# EAGLE design large_led_ring (EAGLE 9.4.2)
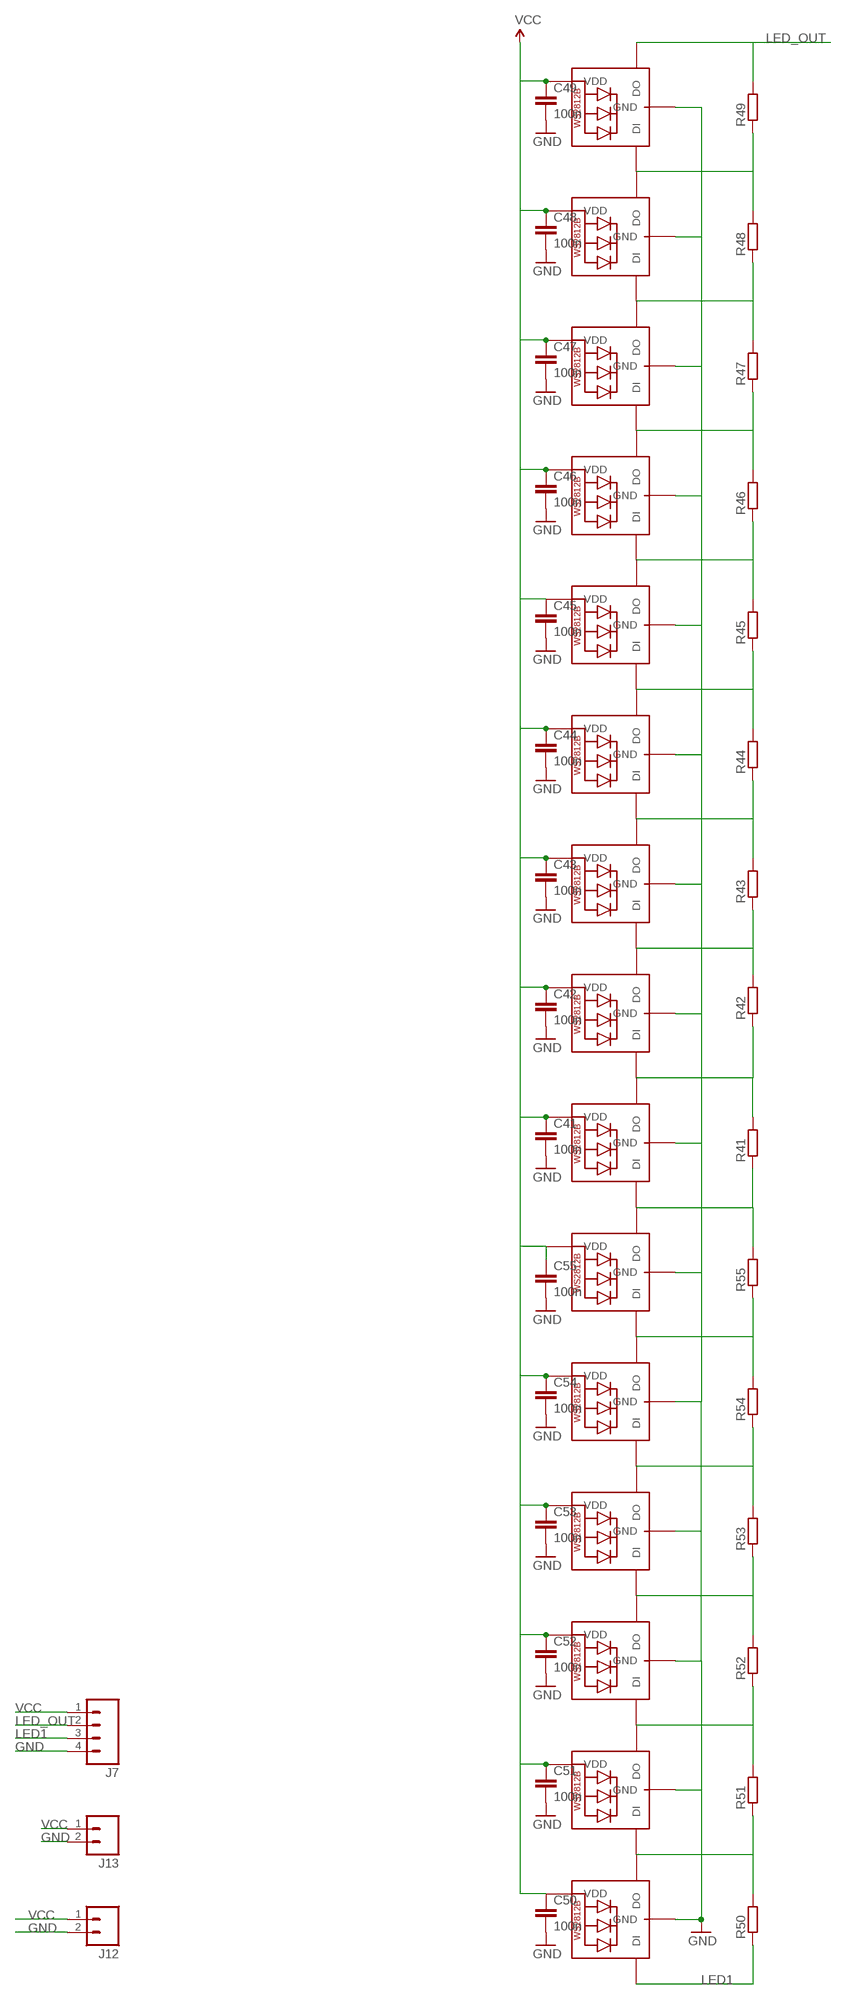
[diagram p0: schematic, sheet 1]

## Parts
C41  100n  CAP0603-CAP  [0603-CAP]
C42  100n  CAP0603-CAP  [0603-CAP]
C43  100n  CAP0603-CAP  [0603-CAP]
C44  100n  CAP0603-CAP  [0603-CAP]
C45  100n  CAP0603-CAP  [0603-CAP]
C46  100n  CAP0603-CAP  [0603-CAP]
C47  100n  CAP0603-CAP  [0603-CAP]
C48  100n  CAP0603-CAP  [0603-CAP]
C49  100n  CAP0603-CAP  [0603-CAP]
C50  100n  CAP0603-CAP  [0603-CAP]
C51  100n  CAP0603-CAP  [0603-CAP]
C52  100n  CAP0603-CAP  [0603-CAP]
C53  100n  CAP0603-CAP  [0603-CAP]
C54  100n  CAP0603-CAP  [0603-CAP]
C55  100n  CAP0603-CAP  [0603-CAP]
J7  M04NO_SILK_ALL_ROUND  [1X04_NO_SILK_ALL_ROUND]
J12  M021X02_NO_SILK  [1X02_NO_SILK]
J13  M021X02_NO_SILK  [1X02_NO_SILK]
LED31  WS2812B3535  [LED3535]
LED32  WS2812B3535  [LED3535]
LED33  WS2812B3535  [LED3535]
LED34  WS2812B3535  [LED3535]
LED35  WS2812B3535  [LED3535]
LED36  WS2812B3535  [LED3535]
LED37  WS2812B3535  [LED3535]
LED38  WS2812B3535  [LED3535]
LED39  WS2812B3535  [LED3535]
LED40  WS2812B3535  [LED3535]
LED41  WS2812B3535  [LED3535]
LED42  WS2812B3535  [LED3535]
LED43  WS2812B3535  [LED3535]
LED44  WS2812B3535  [LED3535]
LED45  WS2812B3535  [LED3535]
R41  R-EU_R0603  [R0603]
R42  R-EU_R0603  [R0603]
R43  R-EU_R0603  [R0603]
R44  R-EU_R0603  [R0603]
R45  R-EU_R0603  [R0603]
R46  R-EU_R0603  [R0603]
R47  R-EU_R0603  [R0603]
R48  R-EU_R0603  [R0603]
R49  R-EU_R0603  [R0603]
R50  R-EU_R0603  [R0603]
R51  R-EU_R0603  [R0603]
R52  R-EU_R0603  [R0603]
R53  R-EU_R0603  [R0603]
R54  R-EU_R0603  [R0603]
R55  R-EU_R0603  [R0603]

## Nets
GND: C41.2 C42.2 C43.2 C44.2 C45.2 C46.2 C47.2 C48.2 C49.2 C50.2 C51.2 C52.2 C53.2 C54.2 C55.2 J7.4 J12.2 J13.2 LED31.4(GND) LED32.4(GND) LED33.4(GND) LED34.4(GND) LED35.4(GND) LED36.4(GND) LED37.4(GND) LED38.4(GND) LED39.4(GND) LED40.4(GND) LED41.4(GND) LED42.4(GND) LED43.4(GND) LED44.4(GND) LED45.4(GND)
LED1: J7.3 LED31.1(DI) R50.1
LED_OUT: J7.2 LED45.3(DO) R49.2
N$3: LED37.3(DO) LED38.1(DI) R41.2 R42.1
N$4: LED38.3(DO) LED39.1(DI) R42.2 R43.1
N$8: LED39.3(DO) LED40.1(DI) R43.2 R44.1
N$16: LED42.3(DO) LED43.1(DI) R46.2 R47.1
N$20: LED43.3(DO) LED44.1(DI) R47.2 R48.1
N$21: LED44.3(DO) LED45.1(DI) R48.2 R49.1
N$23: LED32.3(DO) LED33.1(DI) R51.2 R52.1
N$24: LED33.3(DO) LED34.1(DI) R52.2 R53.1
N$25: LED34.3(DO) LED35.1(DI) R53.2 R54.1
N$26: LED35.3(DO) LED36.1(DI) R54.2 R55.1
N$28: LED31.3(DO) LED32.1(DI) R50.2 R51.1
N$29: LED40.3(DO) LED41.1(DI) R44.2 R45.1
N$30: LED41.3(DO) LED42.1(DI) R45.2 R46.1
N$46: LED36.3(DO) LED37.1(DI) R41.1 R55.2
VCC: C41.1 C42.1 C43.1 C44.1 C45.1 C46.1 C47.1 C48.1 C49.1 C50.1 C51.1 C52.1 C53.1 C54.1 C55.1 J7.1 J12.1 J13.1 LED31.2(VDD) LED32.2(VDD) LED33.2(VDD) LED34.2(VDD) LED35.2(VDD) LED36.2(VDD) LED37.2(VDD) LED38.2(VDD) LED39.2(VDD) LED40.2(VDD) LED41.2(VDD) LED42.2(VDD) LED43.2(VDD) LED44.2(VDD) LED45.2(VDD)

## Library data of the parts
C41-C55 = SparkFun-Capacitors:CAP: Capacitor Standard 0603 ceramic capacitor, and 0.1" leaded capacitor.
J7 = i2c_encoder:M04: Header 4 Standard 4-pin 0.1" header. Use with straight break away headers (SKU : PRT-00116), right angle break away headers (PRT-00553), swiss pins (PRT-00743), machine pins (PRT-00117), and female headers (PRT-00115). Molex polarized connector foot print use with SKU : PRT-08231 with associated crimp pins and housings. 1MM SMD Version SKU: PRT-10208; PROD_ID: CONN-09696
J12 J13 = i2c_encoder:M02: Standard 2-pin 0.1" header. Use with - straight break away headers ( PRT-00116) - right angle break away headers (PRT-00553) - swiss pins (PRT-00743) - machine pins (PRT-00117) - female headers (PRT-00115) Molex polarized connector foot print use with: PRT-08233 with associated crimp pins and housings. 2.54_SCREWTERM for use with PRT-10571. 3.5mm Screw Terminal footprints for PRT-08084 5mm Screw Terminal footprints for use with PRT-08432
LED31-LED45 = i2c_encoder:WS2812B
R41-R55 = rcl:R-EU_: RESISTOR, European symbol

## Board
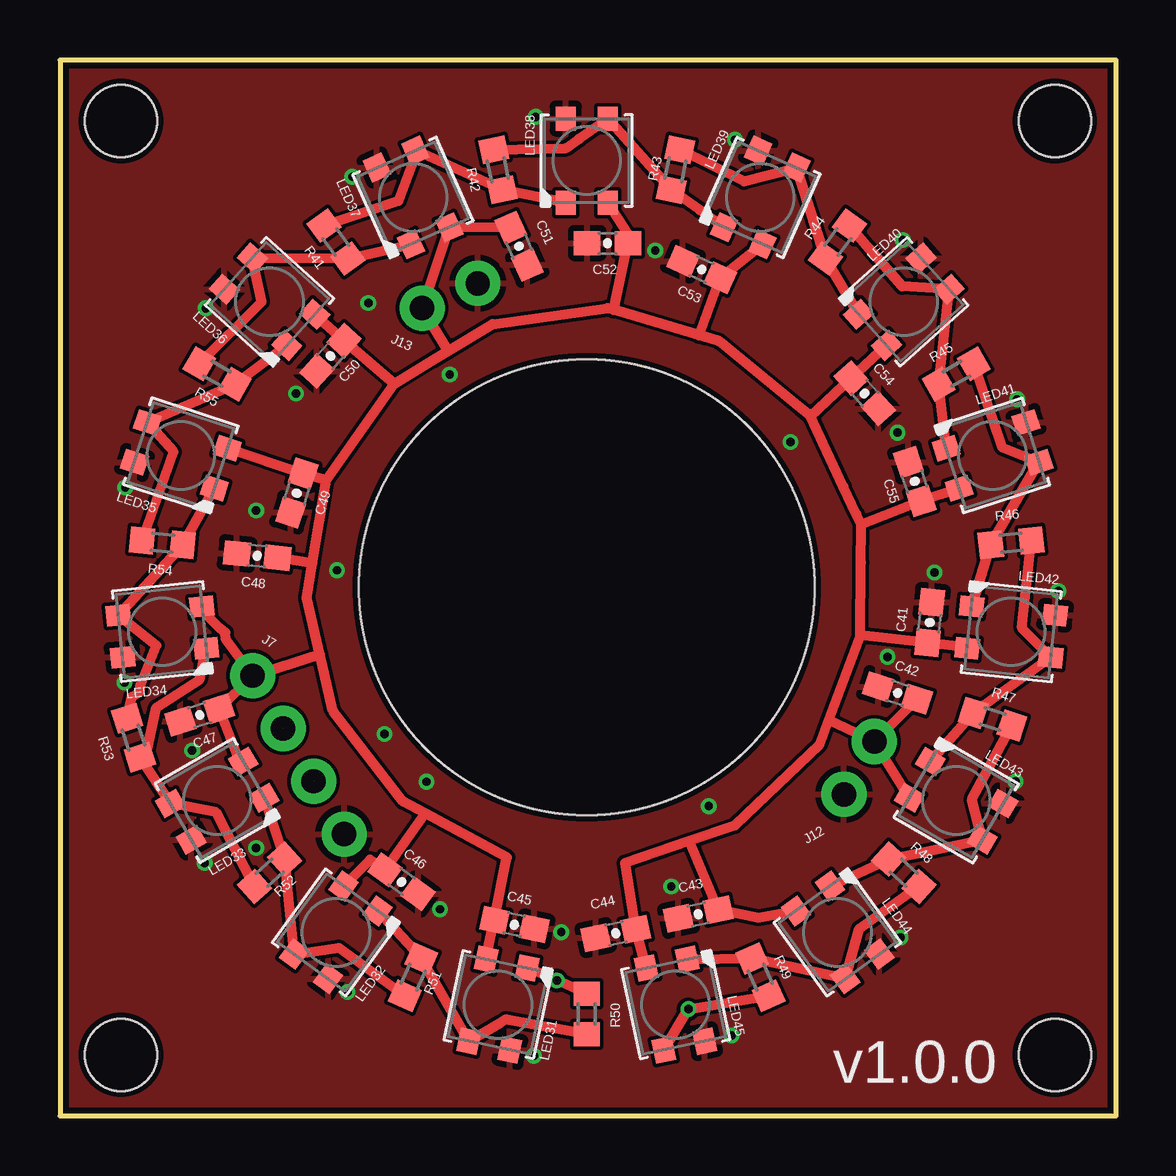
[diagram p1: board, top side]
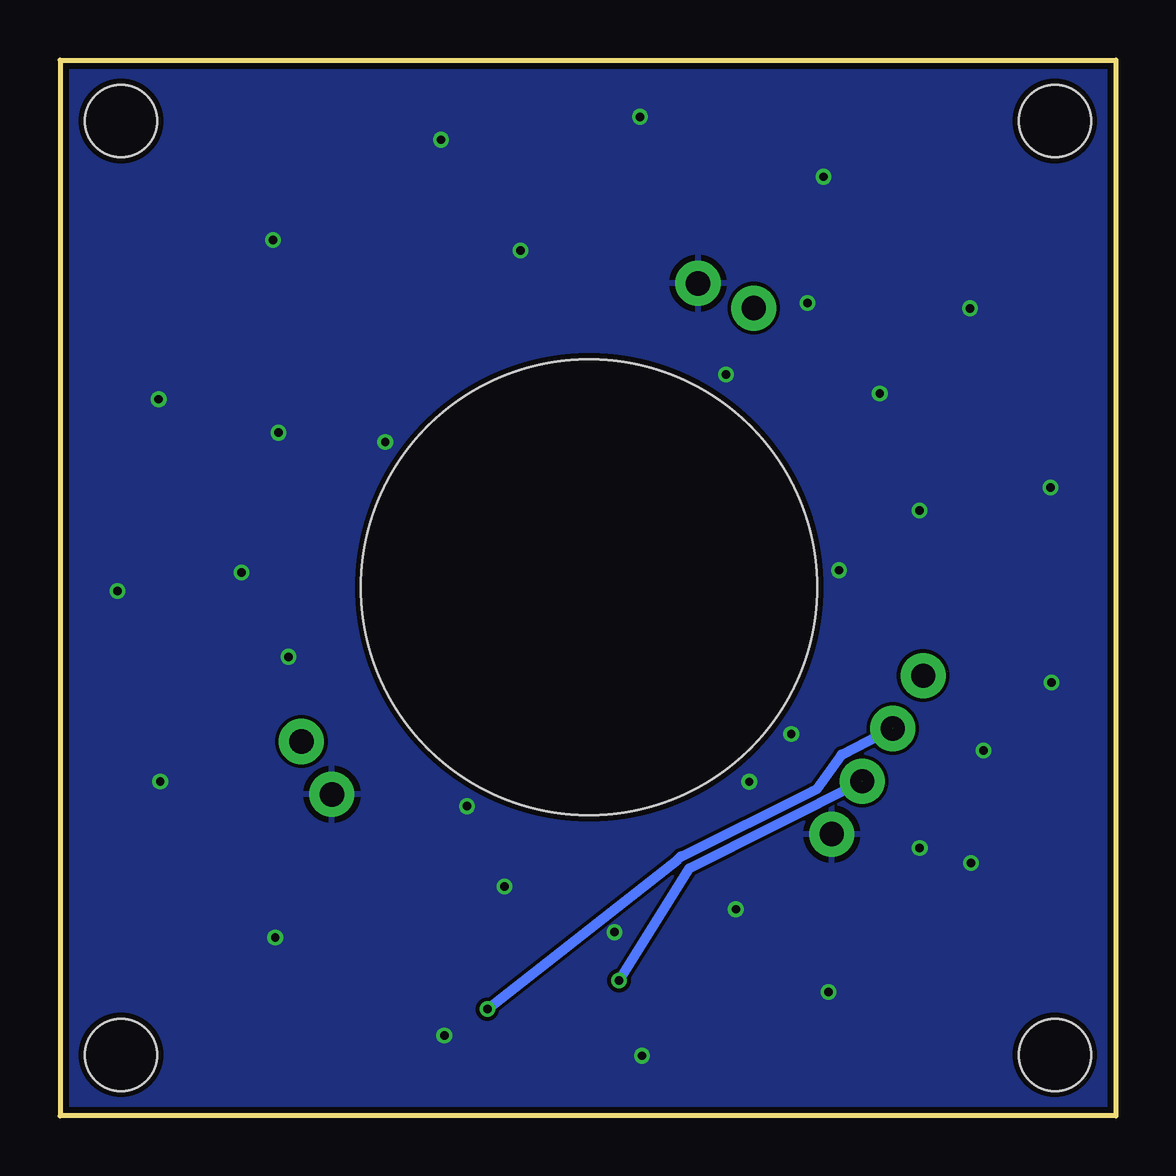
[diagram p2: board, bottom side, seen from below]

Size 43.99 x 43.99 mm. Coordinates in mm from the lower left corner, seen from the top.
Outline: 43.99,43.99 0,43.99 0,0 43.99,0 43.99,43.99
Copper layers (1*16): Top 0.035mm / dielectric 1.5mm / Bottom 0.035mm
Design rules "SeeedStudio_2layer_DRU_no_angle_20140221": minimum track width 6mil, minimum drill 12mil, track to track 6mil, track to pad 6mil, pad to pad 6mil, via to via 6mil, smd to smd 0mil, copper to edge 10mil, drill to drill 10mil, minimum pad ring 10mil, minimum via ring 6mil, stop-mask expansion 2mil, vias tented up to drill 100mil, thermal gap 10mil
Holes 19 mm at 21.95,22.02
Holes 3 mm at 2.54,2.54 2.54,41.45 41.45,41.45 41.45,2.54

### Footprints (pad centres in the part's own frame; a part is rotated, then mirrored left to right if it is on the bottom)
0603-CAP = smd 1.1 x 1: 1 -0.85,0; 2 0.85,0
1X04_NO_SILK_ALL_ROUND = drill 1.016 pad 1.88: 1 0,0; 2 2.54,0; 3 5.08,0; 4 7.62,0
1X02_NO_SILK = drill 1.016 pad 1.88: 1 0,0; 2 2.54,0
LED3535 = smd 1 x 0.85: 1 -1.75,0.875; 2 -1.75,-0.875; 3 1.75,-0.875; 4 1.75,0.875
R0603 = smd 1 x 1.1: 1 -0.85,0; 2 0.85,0

### Placement (x,y rotation side)
C41  36.23,20.55 84 top
C42  34.9,17.62 162 top
C43  26.6,8.4 192 top
C44  23.16,7.6 192 top
C45  18.93,7.97 348 top
C46  14.23,9.75 324 top
C47  5.82,16.7 198 top
C48  8.22,23.34 174 top
C49  9.87,25.95 252 top
C50  11.27,31.67 228 top
C51  19.13,36.23 294 top
C52  22.81,36.36 180 top
C53  26.73,35.27 156 top
C54  33.53,30.1 312 top
C55  35.62,26.43 108 top
J7  8.03,18.34 240 bottom
J12  33.93,15.6 300 bottom
J13  15.09,33.66 156 bottom
LED31  18.25,4.63 258 top
LED32  11.5,7.64 234 top
LED33  6.55,13.13 210 top
LED34  4.26,20.17 186 top
LED35  5.04,27.52 162 top
LED36  8.73,33.92 138 top
LED37  14.71,38.27 114 top
LED38  21.95,39.8 90 top
LED39  29.18,38.27 66 top
LED40  35.16,33.92 42 top
LED41  38.86,27.52 18 top
LED42  39.63,20.17 354 top
LED43  37.34,13.13 330 top
LED44  32.4,7.64 306 top
LED45  25.64,4.63 282 top
R41  11.5,36.41 126 top
R42  18.25,39.42 102 top
R43  25.64,39.42 78 top
R44  32.4,36.41 54 top
R45  37.34,30.91 30 top
R46  39.63,23.88 6 top
R47  38.86,16.53 342 top
R48  35.16,10.13 318 top
R49  29.18,5.78 294 top
R50  21.95,4.24 270 top
R51  14.71,5.78 246 top
R52  8.73,10.13 222 top
R53  3.06,15.76 108 top
R54  4.26,23.88 174 top
R55  6.55,30.91 150 top

### Tracks (layer width: path | path; a pad name or v marks a point on that pad's centre or on a via)
GND  (via drill 0.35)
  other vias: 2.72,26.18 2.68,18.06 6.03,10.53 11.98,5.16 19.74,2.5 27.98,3.35 35.02,7.43 39.82,13.93 41.6,21.86 39.88,29.86 35.11,36.49 28.12,40.67 19.82,41.62 12.18,39.13 6.07,33.65 8.17,25.22 11.54,22.73 15.28,13.92 15.83,8.61 20.89,7.65 25.47,9.55 36.43,22.63 24.8,36.05 16.24,30.89 30.44,28.08 27.03,12.9 13.52,15.91 34.89,28.46 12.85,33.87 9.84,30.09 5.51,15.23 8.17,11.15 34.47,19.12
  pour Top: -2.49,46.13 46.79,46.13 46.79,-2.62 -2.49,-2.62
  pour Bottom: -2.49,46.13 46.79,46.13 46.79,-2.62 -2.49,-2.62
LED1  (via drill 0.35)  (1 unrouted)
  Top 0.406: R50.1 v20.7,5.64 LED31.1
  Bottom 0.406: J7.3 17.78,10.31 v20.7,5.64
LED_OUT  (via drill 0.35)  (1 unrouted)
  Top 0.406: R49.2 v26.18,4.45 LED45.3
  Bottom 0.406: J7.2 11.38,15.06 11.42,15.05 11.43,15.04 12.45,13.62 12.65,13.52 18.08,10.82 18.09,10.81 18.13,10.8 18.15,10.78 18.24,10.71 18.24,10.7 v26.18,4.45
N$3
  Top 0.406: LED38.1 R42.1 14.89,40.18 | 14.89,40.18 LED37.3 | R41.2 14.11,38.12 14.89,40.18
N$4
  Top 0.406: LED39.1 26.65,37.75 R43.1 LED38.3 21.72,40.77 21.64,40.7 21.61,40.7 21.09,40.32 R42.2
N$8
  Top 0.406: LED40.1 R44.1 LED39.3 28.5,38.93 R43.2
N$16
  Top 0.406: LED43.1 R47.1 LED42.3 40.08,20.32 R46.2
N$20
  Top 0.406: LED44.1 R48.1 LED43.3 38,13.18 R47.2
N$21
  Top 0.406: R48.2 33.31,7.8 LED44.3 R49.1 LED45.1
N$23
  Top 0.406: R51.2 11.61,7 LED32.3 R52.1 LED33.1
N$24
  Top 0.406: R52.2 6.5,12.64 LED33.3 R53.1 3.62,15.14 4.02,17 5.82,18.17 LED34.1
N$25
  Top 0.406: LED35.1 R54.1 4.87,23.53 LED34.3 4.02,19.59 3.36,17.95 3.29,17.64 2.99,17.44 R53.2
N$26
  Top 0.406: LED36.1 R55.1 LED35.3 4.74,27.66 R54.2
N$28
  Top 0.406: LED32.1 14.98,6.64 R51.1 LED31.3 18.34,3.88 18.57,4.02 18.73,3.99 R50.2
N$29
  Top 0.406: LED41.1 R45.1 LED40.3 35.09,34.56 33.75,36.11 R44.2
N$30
  Top 0.406: R45.2 39.26,27.84 LED41.3 R46.1 LED42.1
N$46
  Top 0.406: R55.2 8.4,33.91 LED36.3 R41.1 LED37.1
VCC
  Top 0.406: C41.1 37.37,19.57 LED42.2 | 34.26,32.12 LED40.2 C54.1 31.28,29.15 31.25,29.17 | 26.23,11.45 28.13,12.1 30.8,14.65 31.65,15.46 32.03,16.48 | 32.03,16.48 33.35,19.98 33.35,20.03 | 33.38,24.65 33.38,24.49 33.37,23.06 33.35,20.03 | 31.25,29.17 32.65,26.22 33.18,25.07 33.38,24.65 | 31.25,29.17 | 31.25,29.17 30.87,29.48 27.47,32.27 26.87,32.45 26.64,32.52 | 23.07,33.58 26.63,32.52 26.64,32.52 | 16.18,31.87 18.02,32.99 18.03,32.99 22.81,33.66 22.86,33.64 23.07,33.58 | 16.18,31.87 15.56,31.5 13.92,30.5 | 11.1,26.48 13.92,30.5 | 10.52,23.02 11.1,26.48 | 10.52,23.02 10.28,21.59 10.83,19.22 | 10.83,19.22 10.9,18.9 11.37,16.88 12.37,15.58 14.29,13.1 15.21,12.6 | 23.07,33.58 | LED39.2 C53.1 26.64,32.52 | C41.1 33.35,20.03 | LED45.2 C44.1 23.55,10.54 26.23,11.45 | LED44.2 29.04,8.26 C43.1 26.23,11.45 | 15.21,12.6 C46.1 12.92,10.68 LED32.2 | 11.1,26.48 C49.1 LED35.2 | LED36.2 C50.1 13.92,30.5 | LED41.2 C55.1 33.38,24.65 | LED31.2 17.75,6.54 C45.1 18.62,10.77 15.21,12.6 | LED38.2 23.66,36.76 C52.1 23.07,33.58 | 10.52,23.02 C48.1 | 36.3,19.46 C41.1 | LED33.2 7.38,15.01 C47.1 J7.1 | C51.1 LED37.2 J13.1 16.18,31.87 | LED43.2 J12.1 | J12.1 C42.1 | J12.1 32.03,16.48 | J7.1 10.83,19.22 | J7.1 6.92,19.85 6.89,20.14 6.66,20.32 5.91,21.07 LED34.2

### Text on the board
tNames: v1.0.0
Document: the height of an SK6812 is 1.6mm where / as the height for a smd encoder is ~4.5mm | Siirrä X3 ylemmäs? | use WS2812B or SK6812 to save on gpio pins | (0.1 -0.03) | GPIO needed: / I2C: 2 / SPI: 4 (+ interrupt?) / encoder: 2 / leds: 1 / = 5 - 7(/8) | (-0.1 -0.03) | (c> 2 1.9) | 0.5mm FFC max current = 0.55A / http://www.axon-cable.com/publications/FFC-Flat-Cables.pdf | CUTOUT | CUTOUT | F+M headerit päällekkäin on noin 5.1mm? | kooderin korkeus 4+(5-7 kierteet)mm | (0.03 0.1)